# EAGLE design L (EAGLE 9.5.2)
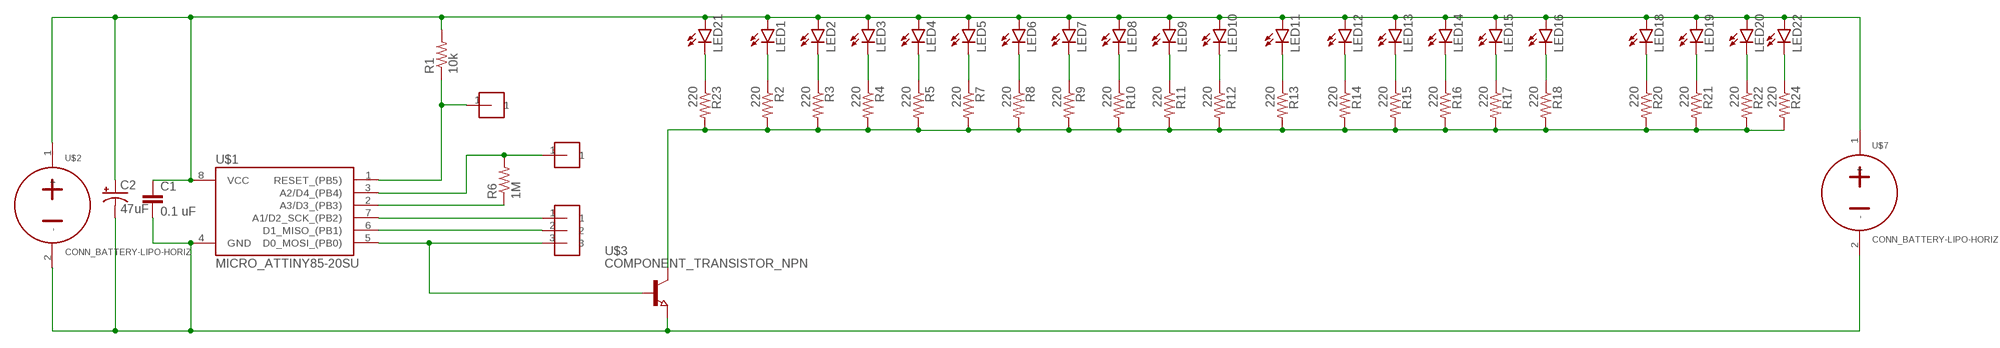
[diagram p0: schematic, sheet 1]

## Parts
C1  0.1 uF  COMPONENT_CAP-0805  [0805]
C2  47uF  COMPONENT_CAP_POL-6.3MM  [CAP_RADIAL_CAN_10MM]
LED1  LED-0805  [CHIP-LED0805]
LED2  LED-0805  [CHIP-LED0805]
LED3  LED-0805  [CHIP-LED0805]
LED4  LED-0805  [CHIP-LED0805]
LED5  LED-0805  [CHIP-LED0805]
LED6  LED-0805  [CHIP-LED0805]
LED7  LED-0805  [CHIP-LED0805]
LED8  LED-0805  [CHIP-LED0805]
LED9  LED-0805  [CHIP-LED0805]
LED10  LED-0805  [CHIP-LED0805]
LED11  LED-0805  [CHIP-LED0805]
LED12  LED-0805  [CHIP-LED0805]
LED13  LED-0805  [CHIP-LED0805]
LED14  LED-0805  [CHIP-LED0805]
LED15  LED-0805  [CHIP-LED0805]
LED16  LED-0805  [CHIP-LED0805]
LED18  LED-0805  [CHIP-LED0805]
LED19  LED-0805  [CHIP-LED0805]
LED20  LED-0805  [CHIP-LED0805]
LED21  LED-0805  [CHIP-LED0805]
LED22  LED-0805  [CHIP-LED0805]
R1  10k  COMPONENT_RESISTOR-0805  [0805]
R2  220  COMPONENT_RESISTOR-0805  [0805]
R3  220  COMPONENT_RESISTOR-0805  [0805]
R4  220  COMPONENT_RESISTOR-0805  [0805]
R5  220  COMPONENT_RESISTOR-0805  [0805]
R6  1M  COMPONENT_RESISTOR-0805  [0805]
R7  220  COMPONENT_RESISTOR-0805  [0805]
R8  220  COMPONENT_RESISTOR-0805  [0805]
R9  220  COMPONENT_RESISTOR-0805  [0805]
R10  220  COMPONENT_RESISTOR-0805  [0805]
R11  220  COMPONENT_RESISTOR-0805  [0805]
R12  220  COMPONENT_RESISTOR-0805  [0805]
R13  220  COMPONENT_RESISTOR-0805  [0805]
R14  220  COMPONENT_RESISTOR-0805  [0805]
R15  220  COMPONENT_RESISTOR-0805  [0805]
R16  220  COMPONENT_RESISTOR-0805  [0805]
R17  220  COMPONENT_RESISTOR-0805  [0805]
R18  220  COMPONENT_RESISTOR-0805  [0805]
R20  220  COMPONENT_RESISTOR-0805  [0805]
R21  220  COMPONENT_RESISTOR-0805  [0805]
R22  220  COMPONENT_RESISTOR-0805  [0805]
R23  220  COMPONENT_RESISTOR-0805  [0805]
R24  220  COMPONENT_RESISTOR-0805  [0805]
U$1  MICRO_ATTINY85-20SU  [SOIC8]
U$2  CONN_BATTERY-LIPO-HORIZ  [JST-PH-2-SMT-RA]
U$3  COMPONENT_TRANSISTOR_NPN  [SOT23]
U$4  HEADER-1-TESTPOINT  [TESTPOINT-1]
U$5  HEADER-1-TESTPOINT  [TESTPOINT-1]
U$6  HEADER-3-TESTPOINT  [TESTPOINT-3]
U$7  CONN_BATTERY-LIPO-HORIZ  [JST-PH-2-SMT-RA]

## Nets
N$1: R1.1 U$1.1(RESET_(PB5)) U$5.1
N$2: C1.1 C2.+ LED1.A LED2.A LED3.A LED4.A LED5.A LED6.A LED7.A LED8.A LED9.A LED10.A LED11.A LED12.A LED13.A LED14.A LED15.A LED16.A LED18.A LED19.A LED20.A LED21.A LED22.A R1.2 U$1.8(VCC) U$2.1(+) U$7.1(+)
N$3: LED22.C R24.1
N$4: LED4.C R5.1
N$5: LED3.C R4.1
N$6: LED2.C R3.1
N$7: LED1.C R2.1
N$8: R2.2 R3.2 R4.2 R5.2 R7.2 R8.2 R9.2 R10.2 R11.2 R12.2 R13.2 R14.2 R15.2 R16.2 R17.2 R18.2 R20.2 R21.2 R22.2 R23.2 R24.2 U$3.3(C)
N$9: U$1.7(A1/D2_SCK_(PB2)) U$6.1
N$10: R6.2 U$1.3(A2/D4_(PB4)) U$4.1
N$11: R6.1 U$1.2(A3/D3_(PB3))
N$12: U$1.6(D1_MISO_(PB1)) U$6.2
N$13: U$1.5(D0_MOSI_(PB0)) U$3.1(B) U$6.3
N$14: LED21.C R23.1
N$15: LED5.C R7.1
N$17: C1.2 C2.- U$1.4(GND) U$2.2(-) U$3.2(E) U$7.2(-)
N$18: LED9.C R11.1
N$19: LED8.C R10.1
N$20: LED7.C R9.1
N$21: LED6.C R8.1
N$24: LED10.C R12.1
N$27: LED14.C R16.1
N$28: LED13.C R15.1
N$29: LED12.C R14.1
N$30: LED11.C R13.1
N$33: LED15.C R17.1
N$36: LED19.C R21.1
N$37: LED18.C R20.1
N$39: LED16.C R18.1
N$42: LED20.C R22.1

## Library data of the parts
C1 = homemade-hardware:COMPONENT_CAP: Capacitor Standard 0603 ceramic capacitor, and 0.1" leaded capacitor.
C2 = homemade-hardware:COMPONENT_CAP_POL: Capacitor Polarized These are standard SMD and PTH capacitors. Normally 47uF, 100uF, and 470uF in electrolytic and tantalum varieties. Always verify the external diameter of the through hole cap, it varies with capacity, voltage, and manufacturer. The EIA devices should be standard.
LED1-LED16 LED18-LED22 = homemade-hardware:LED: LEDs Standard schematic elements and footprints for 5mm, 3mm, 1206, and 0603 sized LEDs. 5mm - Spark Fun Electronics SKU : COM-00529 (and others)
R1-R18 R20-R24 = homemade-hardware:COMPONENT_RESISTOR
U$1 = homemade-hardware:MICRO_ATTINY85
U$2 U$7 = homemade-hardware:CONN_BATTERY
U$3 = homemade-hardware:COMPONENT_TRANSISTOR_NPN: BSS806NH6327XTSA1 <https://www.digikey.com/product-detail/en/infineon-technologies/BSS806NH6327XTSA1/BSS806NH6327XTSA1DKR-ND/3196843>: NPN Moseft Transistor - 20V 2.3A; PN: BSS806NH6327XTSA1
U$4 U$5 = homemade-hardware:HEADER-1: M20-8890845 <https://www.digikey.com/products/en?keywords=952-3236-ND>: Horizontal Male SMD Headers M20-7910842R <https://www.digikey.com/product-detail/en/harwin-inc/M20-7910842R/952-3200-6-ND/6559341>: Horizontal Female SMD Headers
U$6 = homemade-hardware:HEADER-3: NPTC081KFXC-RC <https://www.digikey.com/product-detail/en/sullins-connector-solutions/NPTC081KFXC-RC/S5600-ND/776058>: Vertical Female SMD Headers TSM-110-01-T-SV <https://www.digikey.com/product-detail/en/samtec-inc/TSM-110-01-T-SV/SAM12267-ND/6691889>: Vertical Male SMD Headers M20-8890845 <https://www.digikey.com/products/en?keywords=952-3236-ND>: Horizontal Male SMD Headers M20-7910842R <https://www.digikey.com/product-detail/en/harwin-inc/M20-7910842R/952-3200-6-ND/6559341>: Horizontal Female SMD Headers

## Board
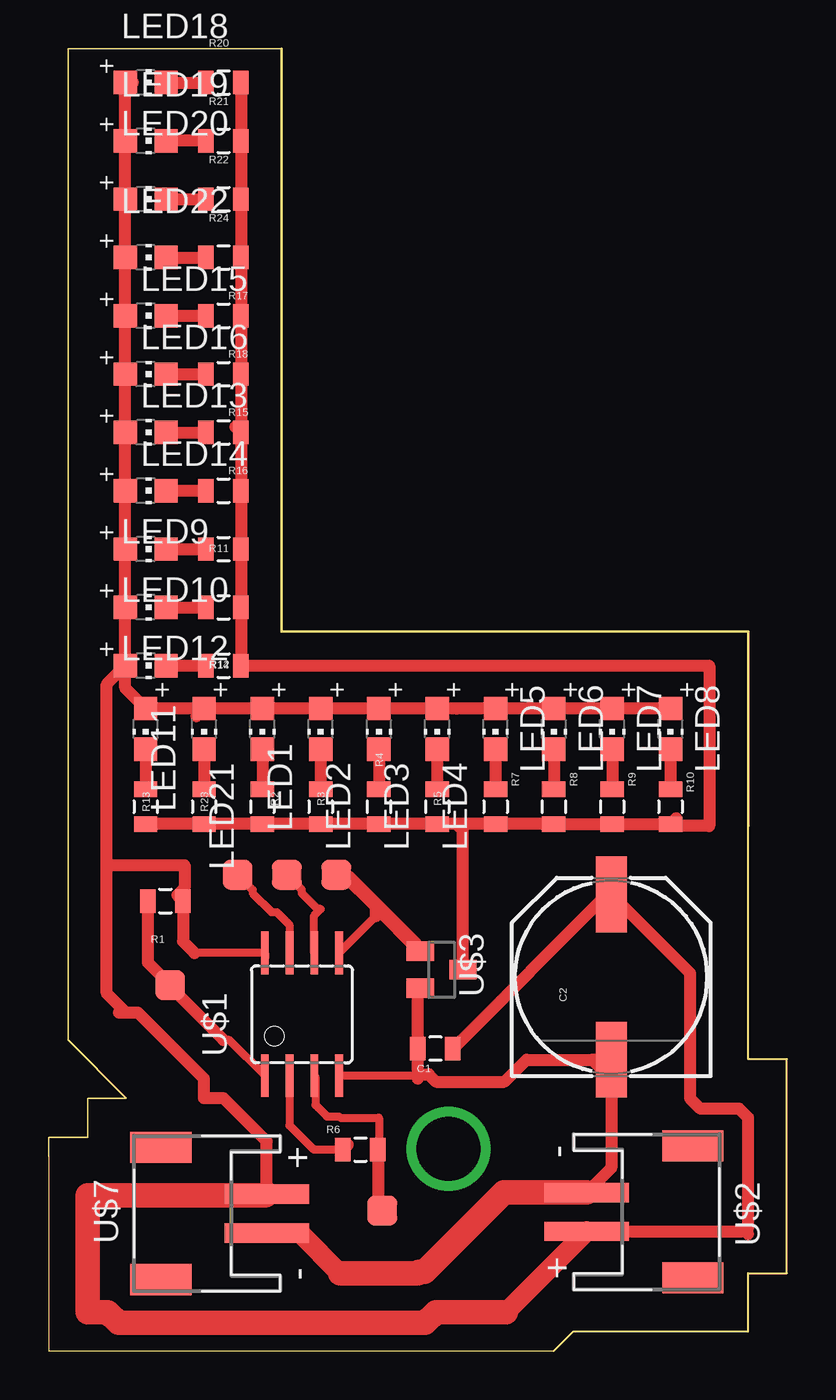
[diagram p1: board, top side]

Size 38 x 67 mm. Coordinates in mm from the lower left corner, seen from the top.
Outline: 0,0 26,0 27,1 36,1 36,4 38,4 38,15 36,15 36,27 36,37 12,37 12,67 1,67 1,16 4,13 2,13 2,11 0,11 0,10 0,0
Copper layers (1*16): Top 0.035mm / dielectric 1.5mm / Bottom 0.035mm
Design rules "default": minimum track width 16mil, minimum drill 0.8mm, track to track 0.8mm, track to pad 0.8mm, pad to pad 0.8mm, via to via 0.8mm, smd to smd 0mil, copper to edge 1mil, drill to drill 1mil, minimum pad ring 10mil, minimum via ring 10mil, stop-mask expansion 1mil, vias tented up to drill 30mil, thermal gap 10mil

### Footprints (pad centres in the part's own frame; a part is rotated, then mirrored left to right if it is on the bottom)
0805 = smd 0.8 x 1.2: 1 -0.9,0; 2 0.9,0
CAP_RADIAL_CAN_10MM = smd 3.9 x 1.6: + 4.25,0; - -4.25,0
CHIP-LED0805 = smd 1.2 x 1.2: A 0,-1.05; C 0,1.05
SOIC8 = smd 0.4 x 2.2: 1 -1.905,-3.154; 2 -0.635,-3.154; 3 0.635,-3.154; 4 1.905,-3.154; 5 1.905,3.154; 6 0.635,3.154; 7 -0.635,3.154; 8 -1.905,3.154
JST-PH-2-SMT-RA = smd 1 x 4.35: 1 1,-3.825; 2 -1,-3.825 | smd 1.6 x 3.15: NC1 -3.4,1.625; NC2 3.4,1.625
SOT23 = smd 1 x 1.4: 1 -0.95,-1.1; 2 0.95,-1.1; 3 0,1.1
TESTPOINT-1 = smd 1.524 x 1.524: 1 0,0
TESTPOINT-3 = smd 1.524 x 1.524: 1 0,0; 2 2.54,0; 3 5.08,0

### Placement (x,y rotation side)
C1  19.91,15.55 180 top
C2  28.95,19.23 90 top
LED1  11,32 180 top
LED2  14,32 180 top
LED3  17,32 180 top
LED4  20,32 180 top
LED5  23,32 180 top
LED6  26,32 180 top
LED7  29,32 180 top
LED8  32,32 180 top
LED9  5,41.25 270 top
LED10  5,38.25 270 top
LED11  5,32 180 top
LED12  5,35.25 270 top
LED13  5,47.25 270 top
LED14  5,44.25 270 top
LED15  5,53.25 270 top
LED16  5,50.25 270 top
LED18  5,65.25 270 top
LED19  5,62.25 270 top
LED20  5,59.25 270 top
LED21  8,32 180 top
LED22  5,56.25 270 top
R1  6.01,23.14 0 top
R2  11,28 270 top
R3  14,28 270 top
R4  17,28 270 top
R5  20,28 270 top
R6  16.05,10.36 0 top
R7  23,28 270 top
R8  26,28 270 top
R9  29,28 270 top
R10  32,28 270 top
R11  9,41.25 0 top
R12  9,38.25 0 top
R13  5,28 270 top
R14  9,35.25 0 top
R15  9,47.25 0 top
R16  9,44.25 0 top
R17  9,53.25 0 top
R18  9,50.25 0 top
R20  9,65.25 0 top
R21  9,62.25 0 top
R22  9,59.25 0 top
R23  8,28 270 top
R24  9,56.25 0 top
U$1  13.04,17.32 0 top
U$2  31.52,7.15 270 top
U$3  20.22,19.61 270 top
U$4  17.16,7.22 0 top
U$5  6.26,18.82 90 top
U$6  9.72,24.5 0 top
U$7  7.4,7.07 90 top

### Tracks (layer width: path | path; a pad name or v marks a point on that pad's centre or on a via)
N$1
  Top 0.406: U$1.1 9.29,16 9,16
  Top 0.61: R1.1 5.11,19.96 U$5.1 6.48,18.82 6.48,18.52 9,16
N$2
  Top 0.406: 11.13,20.19 U$1.8 7.51,20.47
  Top 0.61: 21,33.05 LED4.A | 7.61,32.66 LED21.A | LED21.A 7.87,32.92 | 32,33 LED8.A LED7.A LED6.A LED5.A LED4.A | 4,17.39 4.61,17.39 8,14 8,13 9,13 11.23,10.77 U$7.1 | 4,17.39 3.61,17.39 | 4,17.39 3,18.39 3,25 | 3,25 7,25 7,23.82 6.62,23.44 R1.2 6.91,21.07 7.51,20.47 | LED12.A LED10.A LED9.A LED14.A LED13.A LED16.A LED15.A LED22.A LED20.A LED19.A LED18.A 4.34,65.25 | LED4.A LED3.A LED2.A LED1.A LED21.A | LED21.A LED11.A 3.95,34.1 LED12.A | 3,25 3,34.3 LED12.A | C1.1 28.74,23.48 C2.+ 33,19.44 33,13 33.54,12.46 35.54,12.46 36,12 36,6.31 35.85,6.15 | U$2.1 35.85,6.15 | 35.85,6.15 36,6
  Top 1.016: 23.55,2 U$2.1
  Top 1.27: U$7.1 11.17,8.01 8.46,8.01 8.45,8 2,8 2,2 3.04,2 3.61,1.44 19.36,1.44 19.93,2 23.55,2
N$3
  Top 0.61: LED22.C R24.1
N$4
  Top 0.61: LED4.C R5.1
N$5
  Top 0.61: LED3.C R4.1
N$6
  Top 0.61: LED2.C R3.1
N$7
  Top 0.61: LED1.C R2.1
N$8
  Top 0.61: R15.2 9.61,47.55 | R10.2 32.3,27.39 | 21.16,19.77 U$3.3 21.32,26.78 21,27.1 | R10.2 R9.2 R8.2 R7.2 21,27.1 | 21,27.1 R5.2 R4.2 R3.2 R2.2 R23.2 R13.2 | R20.2 R21.2 R22.2 R24.2 R17.2 R18.2 R15.2 | R15.2 R16.2 R11.2 R12.2 R14.2 34,35.25 34,27 32.1,27 R10.2
N$9
  Top 0.406: U$6.1 10.5,23.72 10.5,23.54 11.46,22.58 11.75,22.58 12.4,21.92 U$1.7
N$10
  Top 0.406: U$1.3 13.74,14.1 13.74,12.65 14.32,12.06 14.94,12.06 15,12 17,12 17,10.05 16.95,10
  Top 0.61: U$4.1 16.95,7.44 16.95,10 R6.2
N$11
  Top 0.406: U$1.2 12.4,11.6 13.64,10.36 R6.1
  Top 0.61: 15.4,10.61 R6.1
N$12
  Top 0.406: U$1.6 13.67,22.4 14,22.73 13.85,22.73 13.04,23.54 13.04,23.72 U$6.2
N$13
  Top 0.406: 19,21 15.51,24.5 U$6.3 | U$1.5 16.84,22.38
  Top 0.61: U$3.1 16.84,22.84 | 16.84,22.84 15.19,24.5 U$6.3 14.94,24.36 | 16.84,22.38 16.84,22.84
N$14
  Top 0.61: LED21.C R23.1
N$15
  Top 0.61: LED5.C R7.1
N$16  (via drill 3.3)
  other vias: 20.59,10.4
N$17
  Top 0.406: 18.84,14.16 19,14.01 | U$1.4 18.94,14.16
  Top 0.61: U$3.2 19,18.54 C1.2 19,14.23 | C2.- 24.59,14.98 23.45,13.85 19.95,13.85 19.56,14.23 19,14.23 | 19,14.01 19,14.23 | C2.- 27.98,14.98 29.04,13.93 | 18.94,14.16 19,14.23 | C2.- 28.95,9.41 U$2.2
  Top 1.016: U$7.2 12.93,6.07 15,4
  Top 1.27: 15,4 19,4 19.07,4.07 19.34,4.07 23.43,8.15 U$2.2
N$18
  Top 0.61: LED9.C R11.1
N$19
  Top 0.61: LED8.C R10.1
N$20
  Top 0.61: LED7.C R9.1
N$21
  Top 0.61: LED6.C R8.1
N$24
  Top 0.61: LED10.C R12.1
N$27
  Top 0.61: LED14.C R16.1
N$28
  Top 0.61: LED13.C R15.1
N$29
  Top 0.61: LED12.C R14.1
N$30
  Top 0.61: LED11.C R13.1
N$33
  Top 0.61: LED15.C R17.1
N$36
  Top 0.61: R21.1 LED19.C
N$37
  Top 0.61: LED18.C R20.1
N$39
  Top 0.61: LED16.C R18.1
N$42
  Top 0.61: LED20.C R22.1